# Altium project gc_mc.PrjPCB
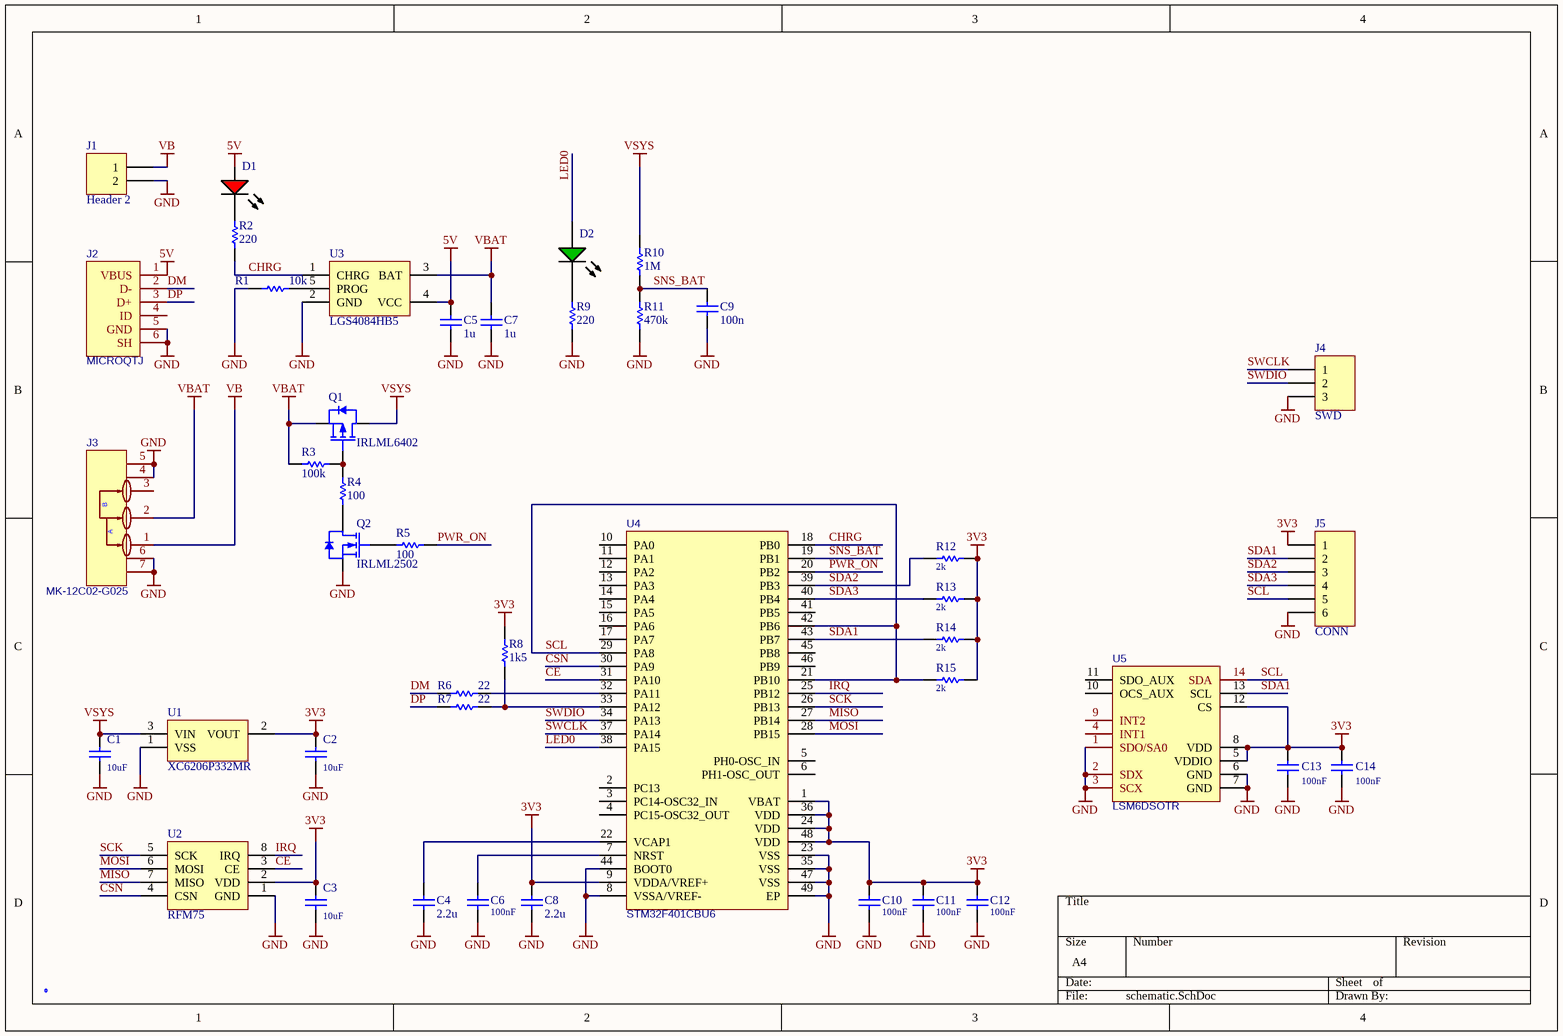
[diagram p0: schematic.SchDoc]
PRJ_ID: GC MC; PRJ_VER: v1.0.0
1 sheet, 44 parts. Net scope: global (net labels, ports and power ports of the same name join across sheets).
Board file: board.PcbDoc

## Sheet schematic.SchDoc
size A4; SheetNumber: 6; SheetTotal: 29

### Parts
C1  10uF  [C0603]
C2  10uF  [C0603]
C3  10uF  [C0805]
C4  2.2u  [C0603]
C5  1u  [C0805]
C6  100nF  [C0402]
C7  1u  [C0805]
C8  2.2u  [C0603]
C9  100n  [C0402]
C10  100nF  [C0402]
C11  100nF  [C0402]
C12  100nF  [C0402]
C13  100nF  [C0402]
C14  100nF  [C0402]
D1  RED  [LED-0603-RED]  (value not drawn)
D2  GRN  [LED-0603-GRN]  (value not drawn)
J1  Header 2  [HDR-1X2_2.54]  (no BOM)
J2  MICROQTJ  [CONN-USB-MICRO_#1]
J3  MK-12C02-G025  [SW-SMD_MK-12C02-G025]
J4  SWD  [HDR-1x3-P1.25]  (no BOM)
J5  CONN  [HDR-1x6-P1.25]  (no BOM)
LOGO1  LOGO  [LOGO]  (value not drawn)  (no BOM)
Q1  IRLML6402  [SOT-23]
Q2  IRLML2502  [SOT-23]
R1  10k  [R0402]
R2  220  [R0402]
R3  100k  [R0402]
R4  100  [R0402]
R5  100  [R0402]
R6  22  [R0402]
R7  22  [R0402]
R8  1k5  [R0402]
R9  220  [R0402]
R10  1M  [R0402]
R11  470k  [R0402]
R12  2k  [R0402]
R13  2k  [R0402]
R14  2k  [R0402]
R15  2k  [R0402]
U1  XC6206P332MR  [SOT-23]
U2  RFM75  [RFM75]
U3  LGS4084HB5  [SOT-23-5]
U4  STM32F401CBU6  [UFQFPN-48_L7.0-W7.0]
U5  LSM6DSOTR  [LGA-14_L3.0-W2.5-P0.50-TL]

### Nets
3V3: C2.2 C3.2 C8.2 C10.2 C11.2 C12.2 C13.2 C14.2 J5.1 R8.1 R12.1 R13.1 R14.1 R15.1 U1.2(VOUT) U2.2(VDD) U4.1(VBAT) U4.9(VDDA/VREF+) U4.24(VDD) U4.36(VDD) U4.48(VDD) U5.5(VDDIO) U5.8(VDD) U5.12(CS)
5V: C5.2 D1.1(A) J2.1(VBUS) U3.4(VCC)
GND: C1.1 C2.1 C3.1 C4.1 C5.1 C6.1 C7.1 C8.1 C9.1 C10.1 C11.1 C12.1 C13.1 C14.1 J1.2 J2.5(GND) J2.6(SH) J3.4 J3.5 J3.6 J3.7 J4.3 J5.6 Q2.2(SOURCE) R1.2 R9.1 R11.1 U1.1(VSS) U2.1(GND) U3.2(GND) U4.8(VSSA/VREF-) U4.23(VSS) U4.35(VSS) U4.44(BOOT0) U4.47(VSS) U4.49(EP) U5.1(SDO/SA0) U5.2(SDX) U5.3(SCX) U5.6(GND) U5.7(GND)
VB: J1.1 J3.1
VBAT: C7.2 J3.2 Q1.2(SOURCE) R3.2 U3.3(BAT)
VSYS: C1.2 Q1.3(DRAIN) R10.2 U1.3(VIN)
CE: U2.3(CE) U4.31(PA10)
CHRG: R2.1 U3.1(CHRG) U4.18(PB0)
CSN: U2.4(CSN) U4.30(PA9)
DM: J2.2(D-) R6.2
DP: J2.3(D+) R7.2
IRQ: U2.8(IRQ) U4.25(PB12)
LED0: D2.1(A) U4.38(PA15)
MISO: U2.7(MISO) U4.27(PB14)
MOSI: U2.6(MOSI) U4.28(PB15)
PWR_ON: R5.1 U4.20(PB2)
SCK: U2.5(SCK) U4.26(PB13)
SCL: J5.5 R15.2 U4.21(PB10) U4.29(PA8) U4.42(PB6) U5.14(SDA)
SDA1: J5.2 R14.2 U4.43(PB7) U5.13(SCL)
SDA2: J5.3 R12.2 U4.39(PB3)
SDA3: J5.4 R13.2 U4.40(PB4)
SNS_BAT: C9.2 R10.1 R11.2 U4.19(PB1)
SWCLK: J4.1 U4.37(PA14)
SWDIO: J4.2 U4.34(PA13)
NetC4_2: C4.2 U4.22(VCAP1)
NetC6_2: C6.2 U4.7(NRST)
NetD1_2: D1.2(K) R2.2
NetD2_2: D2.2(K) R9.2
NetQ1_1: Q1.1(GATE) R3.1 R4.2
NetQ2_1: Q2.1(GATE) R5.2
NetQ2_3: Q2.3(DRAIN) R4.1
NetR1_1: R1.1 U3.5(PROG)
NetR6_1: R6.1 U4.32(PA11)
NetR7_1: R7.1 R8.2 U4.33(PA12)

Not connected (* = marked no-connect by the designer): J2 4(ID); J3 3; U4 2(PC13) 3(PC14-OSC32_IN) 4(PC15-OSC32_OUT) 5(PH0-OSC_IN) 6(PH1-OSC_OUT) 10(PA0) 11(PA1) 12(PA2) 13(PA3) 14(PA4) 15(PA5) 16(PA6) 17(PA7) 41(PB5) 45(PB8) 46(PB9); U5 4(INT1) 9(INT2) 10(OCS_AUX) 11(SDO_AUX)

### Notes on the sheet
- (in symbol MK-12C02-G025) B; A

### Library data of the parts
C1-C3 C6 C10-C12 = CAP
C4 C5 C7-C9 = Cap
C13 C14 = CAP: P/N: CC0402KRX7R9BB104; LCSC part number: C131394
D1 = LED-0603-RED: LED 0603 RED
D2 = LED-0603-GREEN: LED 0603 GRN
J4 J5 = Header 3
Q1 Q2 = 2N7002
R1-R11 = Res1
R12-R15 = RES
U1 = Component_4_1
J3 = MK-12C02-G025: LCSC part number: C778186; P/N: MK-12C02-G025
U4 = STM32F401CBU6: LCSC part number: C118825; P/N: STM32F401CBU6
U5 = LSM6DSOTR: LCSC part number: C2655100; P/N: LSM6DSOTR